# Altium schematic sheet Power.SchDoc
size A4
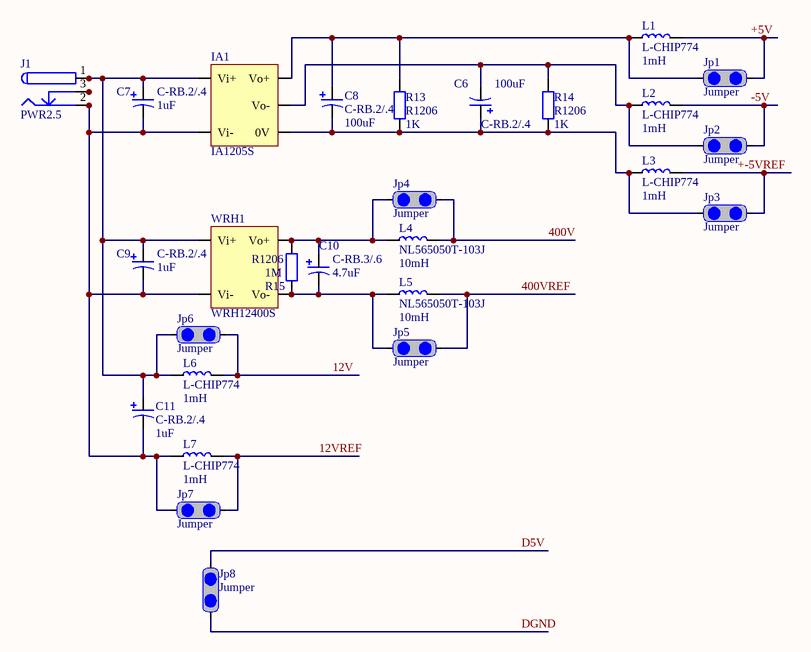
[diagram p0: Power.SchDoc]

## Parts
C6  C-RB.2/.4  value 100uF  [RB.2/.4]
C7  C-RB.2/.4  value 1uF  [RB.2/.4]
C8  C-RB.2/.4  value 100uF  [RB.2/.4]
C9  C-RB.2/.4  value 1uF  [RB.2/.4]
C10  C-RB.3/.6  value 4.7uF  [RB.3/.6]
C11  C-RB.2/.4  value 1uF  [RB.2/.4]
IA1  IA1205S  [IA1205S]
J1  PWR2.5  [KLD-0202]
Jp1  Jumper  [JUMPER]
Jp2  Jumper  [JUMPER]
Jp3  Jumper  [JUMPER]
Jp4  Jumper  [JUMPER]
Jp5  Jumper  [JUMPER]
Jp6  Jumper  [JUMPER]
Jp7  Jumper  [JUMPER]
Jp8  Jumper  [JUMPER]
L1  L-CHIP774  value 1mH  [INDUCTOR070704]
L2  L-CHIP774  value 1mH  [INDUCTOR070704]
L3  L-CHIP774  value 1mH  [INDUCTOR070704]
L4  NL565050T-103J  value 10mH  [NL565050T]
L5  NL565050T-103J  value 10mH  [NL565050T]
L6  L-CHIP774  value 1mH  [INDUCTOR070704]
L7  L-CHIP774  value 1mH  [INDUCTOR070704]
R13  R1206  value 1K  [1206]
R14  R1206  value 1K  [1206]
R15  R1206  value 1M  [1206]
WRH1  WRH12400S  [WRH12400S]

## Nets
12V: Jp6.2(b) L6.2
12VREF: Jp7.2(b) L7.2
400V: Jp4.2(b) L4.2
400VREF: Jp5.2(b) L5.2
+5V: Jp1.2(b) L1.2
+-5VREF: Jp3.2(b) L3.2
-5V: Jp2.2(b) L2.2
D5V: Jp8.2(b)
DGND: Jp8.1(a)
NetC6_1: C6.1(a) IA1.9(Vo-) Jp2.1(a) L2.1 R14.2(b)
NetC6_2: C6.2(b) C8.1(a) IA1.10(0V) Jp3.1(a) L3.1 R13.1(a) R14.1(a)
NetC7_1: C7.1(a) C9.1(a) C11.1(a) IA1.2(Vi-) J1.2 J1.2A J1.2B Jp7.1(a) L7.1 WRH1.2(Vi-)
NetC7_2: C7.2(b) C9.2(b) C11.2(b) IA1.1(Vi+) J1.1 J1.1A J1.1B Jp6.1(a) L6.1 WRH1.1(Vi+)
NetC8_2: C8.2(b) IA1.7(Vo+) Jp1.1(a) L1.1 R13.2(b)
NetC10_1: C10.1(a) Jp5.1(a) L5.1 R15.1(a) WRH1.5(Vo-)
NetC10_2: C10.2(b) Jp4.1(a) L4.1 R15.2(b) WRH1.3(Vo+)
NetJ1_3: J1.3 J1.3A J1.3B

## Library data of the parts
C6-C9 C11 = C-RB.2/.4: Capacitor
C10 = C-RB.3/.6: Capacitor
IA1 = IA1205S: IA1205S,12V to +5V,-5V
J1 = PWR2.5: Low Voltage Power Supply Connector; Published: 17-Dec-2003; DatasheetDocument: 09-May-2002; Publisher: Altium Limited; ComponentLink1Description: Manufacturer Link; ComponentLink1URL: http://domino.kycon.com/internet/Products.html
L1-L3 L6 L7 = Inductor070704: Chip Inductor, 7*7*4
L4 L5 = NL565050T-103J: NL565050T, 10mH, 150 ohm
R13-R15 = R1206: Resistor, 1206, 1/4W
WRH1 = WRH12400S: WRH12400S,12V-400V